# EAGLE design lpm (EAGLE 9.5.2)
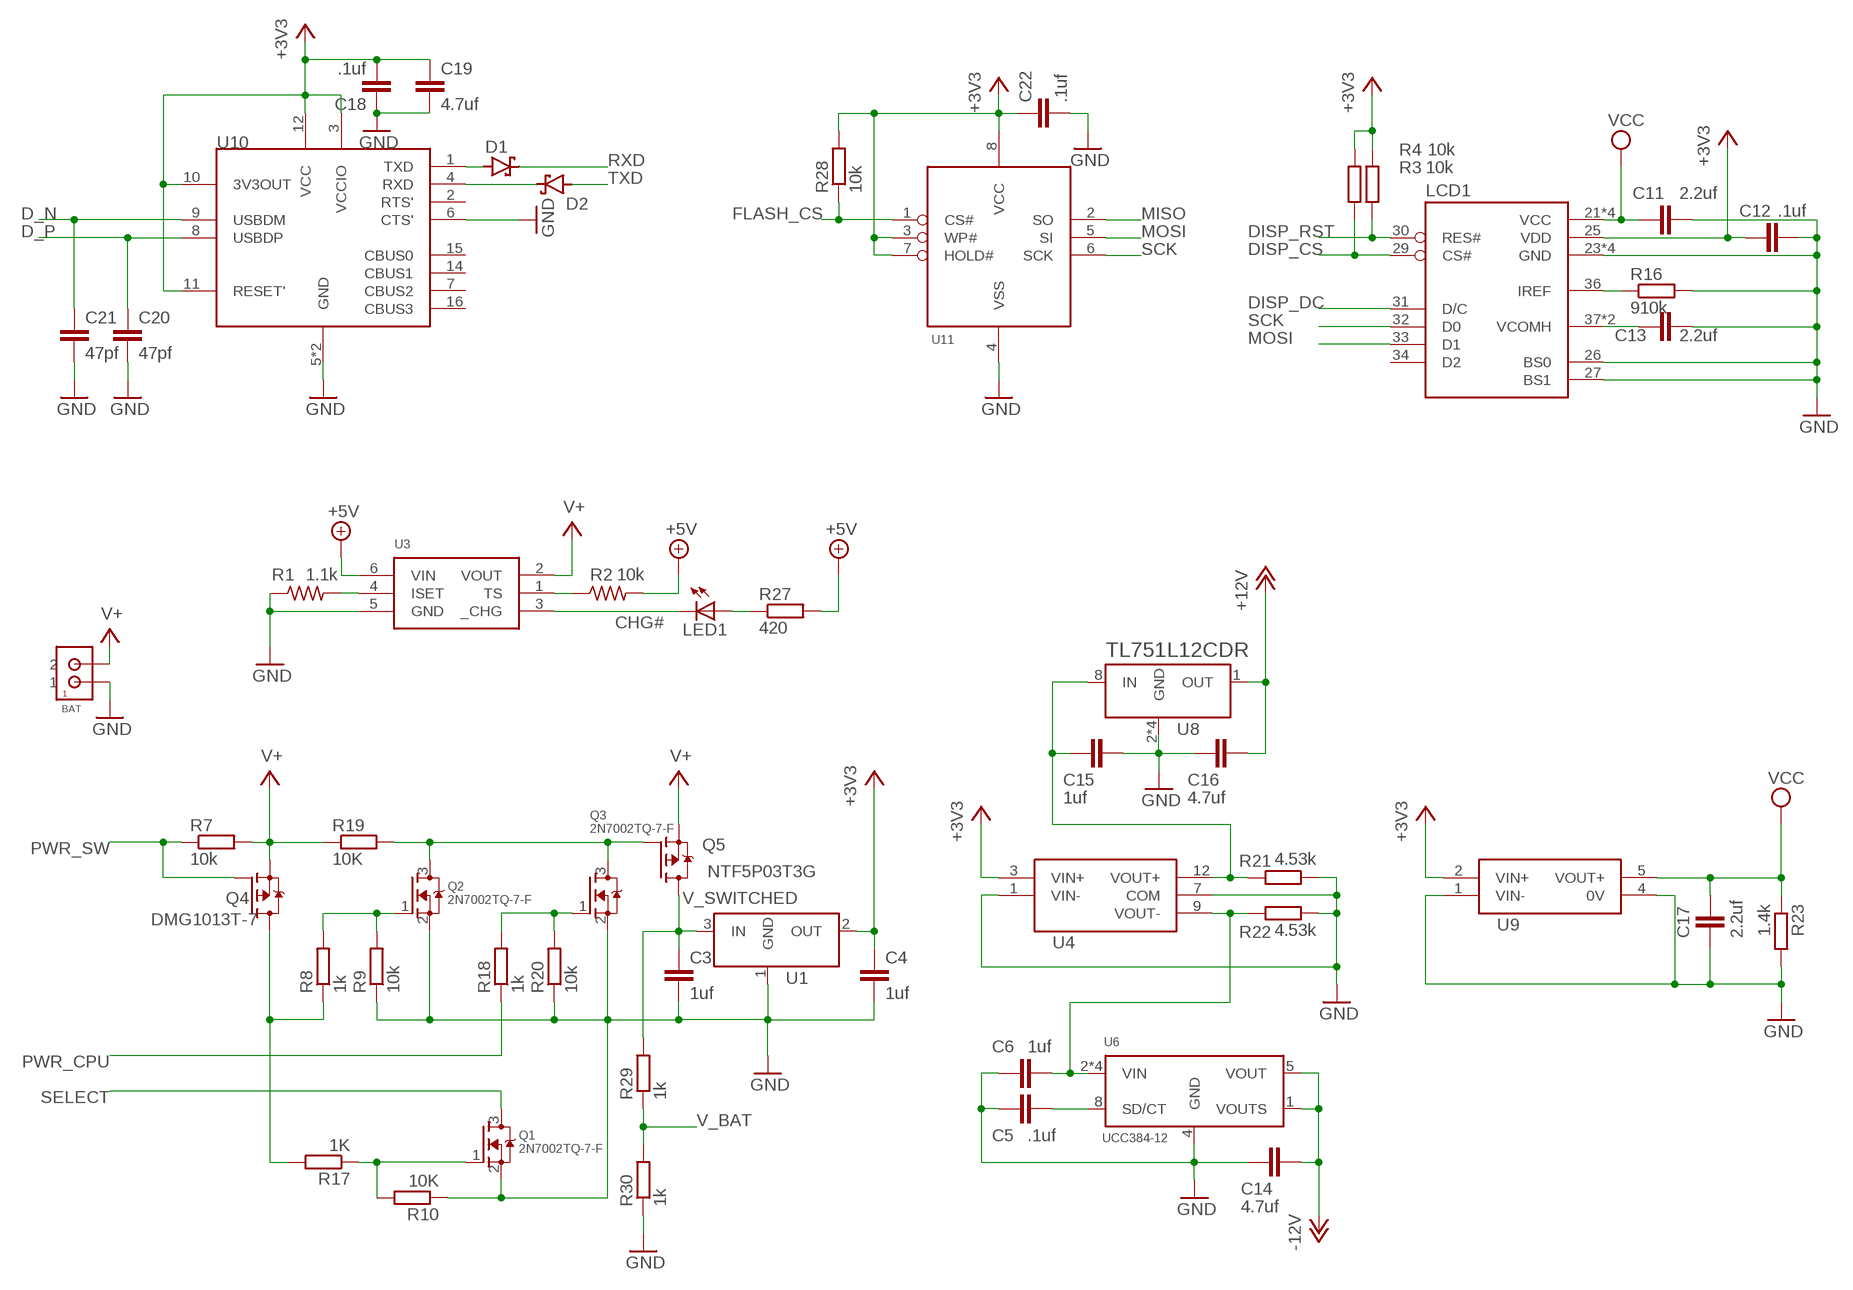
[diagram p0: schematic, sheet 1, part 1 of 2]
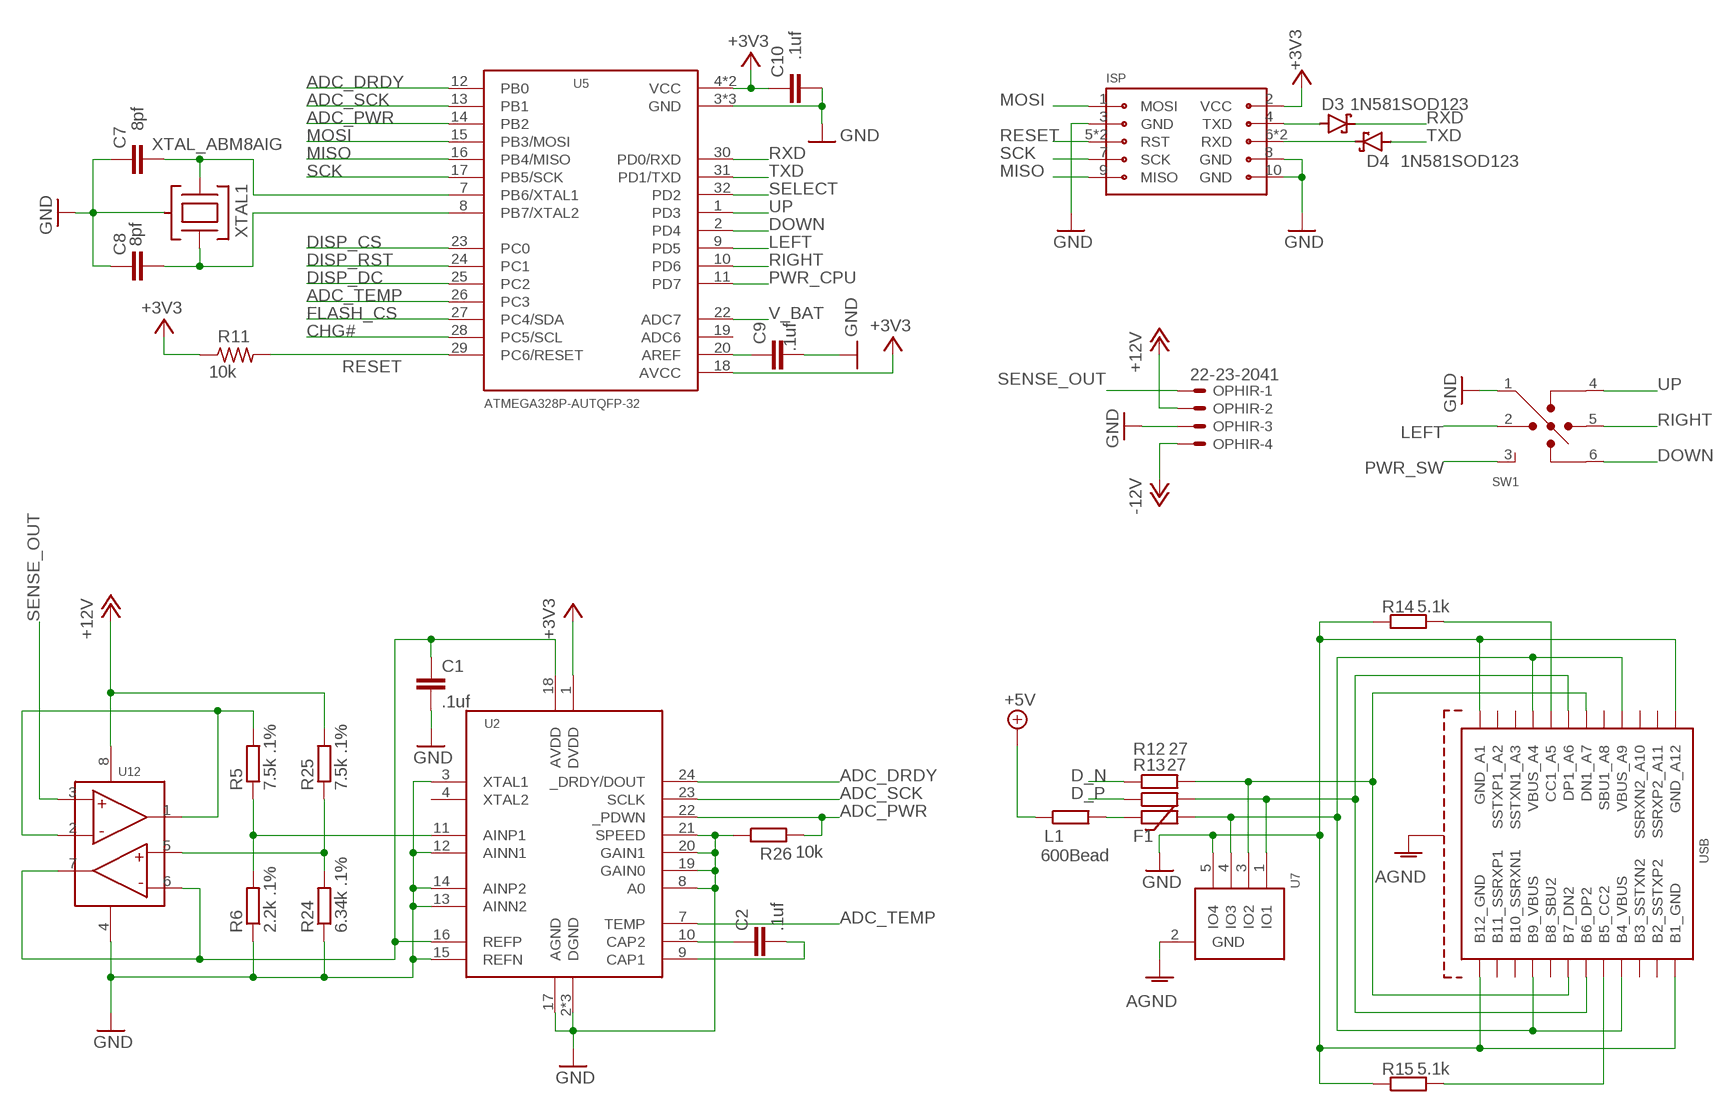
[diagram p1: schematic, sheet 1, part 2 of 2]

## Parts
BAT  2PIN_CONNJST_SH  [JST-SM02B-SRSS-TB]
C1  .1uf  C-EUC0805  [C0805]
C2  .1uf  C-EUC0805  [C0805]
C3  1uf  C-EUC0805  [C0805]
C4  1uf  C-EUC0805  [C0805]
C5  .1uf  C-EUC0805  [C0805]
C6  1uf  C-EUC0805  [C0805]
C7  8pf  C-EUC0805  [C0805]
C8  8pf  C-EUC0805  [C0805]
C9  .1uf  C-EUC0805  [C0805]
C10  .1uf  C-EUC0805  [C0805]
C11  2.2uf  C-EUC0805  [C0805]
C12  .1uf  C-EUC0805  [C0805]
C13  2.2uf  C-EUC0805  [C0805]
C14  4.7uf  C-EUC0805  [C0805]
C15  1uf  C-EUC0805  [C0805]
C16  4.7uf  C-EUC0805  [C0805]
C17  2.2uf  C-EUC0805  [C0805]
C18  .1uf  C-EUC0805  [C0805]
C19  4.7uf  C-EUC0805  [C0805]
C20  47pf  C-EUC0805  [C0805]
C21  47pf  C-EUC0805  [C0805]
C22  .1uf  C-EUC0805  [C0805]
D1  1N581SOD123  [SOD3715X135]
D2  1N581SOD123  [SOD3715X135]
D3  1N581SOD123  [SOD3715X135]
D4  1N581SOD123  [SOD3715X135]
F1  MF-PSHT035KX-2  PTC0805  [FUSC2113X120N]
ISP  10PIN_ISPTC2050  [TC2050-IDC]
L1  600Bead  R-EU_M0805  [M0805]
LCD1  EAOLEDL128-6  [EAOLEDL128-6]
LED1  LEDCHIPLED_0805  [CHIPLED_0805]
OPHIR  22-23-2041  [22-23-2041]
Q1  2N7002TQ-7-F  MOSFET-NSOT-523  [SOT50P160X80-3]
Q2  2N7002TQ-7-F  MOSFET-NSOT-523  [SOT50P160X80-3]
Q3  2N7002TQ-7-F  MOSFET-NSOT-523  [SOT50P160X80-3]
Q4  DMG1013T-7  MOSFET-PSOT-523  [SOT50P160X80-3]
Q5  NTF5P03T3G  MOSFET-PSOT-223  [SOT230P700X180-4]
R1  1.1k  R-US_R0805  [R0805]
R2  10k  R-US_R0805  [R0805]
R3  10k  R-EU_R0805  [R0805]
R4  10k  R-EU_R0805  [R0805]
R5  7.5k .1%  R-EU_R0805  [R0805]
R6  2.2k .1%  R-EU_R0805  [R0805]
R7  10k  R-EU_R0805  [R0805]
R8  1k  R-EU_R0805  [R0805]
R9  10k  R-EU_R0805  [R0805]
R10  10K  R-EU_R0805  [R0805]
R11  10k  R-US_R0805  [R0805]
R12  27  R-EU_M0805  [M0805]
R13  27  R-EU_M0805  [M0805]
R14  5.1k  R-EU_M0805  [M0805]
R15  5.1k  R-EU_M0805  [M0805]
R16  910k  R-EU_R0805  [R0805]
R17  1K  R-EU_R0805  [R0805]
R18  1k  R-EU_R0805  [R0805]
R19  10K  R-EU_R0805  [R0805]
R20  10k  R-EU_R0805  [R0805]
R21  4.53k  R-EU_R0805  [R0805]
R22  4.53k  R-EU_R0805  [R0805]
R23  1.4k  R-EU_R0805  [R0805]
R24  6.34k .1%  R-EU_R0805  [R0805]
R25  7.5k .1%  R-EU_R0805  [R0805]
R26  10k  R-EU_R0805  [R0805]
R27  420  R-EU_R0805  [R0805]
R28  10k  R-EU_R0805  [R0805]
R29  1k  R-EU_R0805  [R0805]
R30  1k  R-EU_R0805  [R0805]
SW1  JS-5208  [JS-5208]
U1  AZ1117E-3.3SOT-223  [SOT230P700X180-4]
U2  ADS1232  [SOP65P640X120-24]
U3  BQ21040SOT-23  [SOT95P280X145-6]
U4  NTA0315MC-R  [NTA0315MC-R]
U5  ATMEGA328P-AUTQFP-32  [QFP80P887X887X120-32]
U6  UCC384-12  UCC384-X  [SOIC127P599X175-8]
U7  ESDS314  [SOT95P282X145-5]
U8  TL751L12CDR  TL751  [SOIC127P599X175-8]
U9  ISE0312A  ISE312A  [ISE0312A]
U10  FT230XSSOP16  [SOP63P599X175-16]
U11  NV25640DWHFT3G  NV25640SOIC-8  [SOIC127P599X175-8]
U12  OPA2210VSSOP8  [SOP65P490X110-8]
USB  USBC_FEMALEUJ31-CH-31-SMT-TR  [USBC_UJ31-CH-31-SMT-TR]
XTAL1  XTAL_ABM8AIG  [XTAL_SMT_3.2X2.5]

## Nets
+3V3 [power]: C4.1 C10.1 C12.1 C18.2 C19.1 C22.1 ISP.2(VCC) LCD1.25(VDD) R3.2 R4.2 R11.1 R28.2 U1.2(OUT) U2.1(DVDD) U4.3(VIN+) U5.4(VCC) U5.6(VCC) U5.18(AVCC) U9.2(VIN+) U10.3(VCCIO) U10.10(3V3OUT) U10.11(RESET') U10.12(VCC) U11.3(WP#) U11.7(HOLD#) U11.8(VCC)
+5V [power]: L1.1 R2.2 R27.2 U3.6(VIN)
+12V [power]: C16.2 OPHIR.2 R25.2 U8.1(OUT) U12.8(V+)
-12V [power]: C14.2 OPHIR.4 U6.1(VOUTS) U6.5(VOUT)
ADC_DRDY: U2.24(_DRDY/DOUT) U5.12(PB0)
ADC_PWR: R26.2 U2.22(_PDWN) U5.14(PB2)
ADC_SCK: U2.23(SCLK) U5.13(PB1)
ADC_TEMP: U2.7(TEMP) U5.26(PC3)
AGND: U7.2(GND) USB.SHLD@1(SHLD) USB.SHLD@2(SHLD) USB.SHLD@3(SHLD) USB.SHLD@4(SHLD) USB.SHLD@5(SHLD) USB.SHLD@6(SHLD) USB.SHLD@7(SHLD) USB.SHLD@8(SHLD)
CHG#: LED1.C U3.3(_CHG) U5.28(PC5/SCL)
D_N: C21.1 R12.1 U10.9(USBDM)
D_P: C20.1 R13.1 U10.8(USBDP)
DISP_CS: LCD1.29(CS#) R4.1 U5.23(PC0)
DISP_DC: LCD1.31(D/C) U5.25(PC2)
DISP_RST: LCD1.30(RES#) R3.1 U5.24(PC1)
DOWN: SW1.6(D) U5.2(PD4)
FLASH_CS: R28.1 U5.27(PC4/SDA) U11.1(CS#)
GND [power]: BAT.1 C1.2 C3.2 C4.2 C5.1 C6.1 C7.1 C8.1 C9.2 C10.2 C11.2 C12.2 C13.2 C14.1 C15.2 C16.1 C17.2 C18.1 C19.2 C20.2 C21.2 C22.2 ISP.3(GND) ISP.8(GND) ISP.10(GND) LCD1.23(GND) LCD1.24(GND) LCD1.26(BS0) LCD1.27(BS1) LCD1.28(GND) LCD1.35(GND) OPHIR.3 Q1.2(S) Q2.2(S) Q3.2(S) R1.1 R6.1 R9.1 R10.1 R14.1 R15.1 R16.2 R20.1 R21.2 R22.2 R23.2 R24.1 R26.1 R30.1 SW1.1(C) U1.1(GND) U2.2(DGND) U2.3(XTAL1) U2.5(DGND) U2.6(DGND) U2.8(A0) U2.12(AINN1) U2.13(AINN2) U2.14(AINP2) U2.15(REFN) U2.17(AGND) U2.19(GAIN0) U2.20(GAIN1) U2.21(SPEED) U3.5(GND) U4.1(VIN-) U4.7(COM) U5.3(GND) U5.5(GND) U5.21(GND) U6.4(GND) U7.5(IO4) U8.2(GND) U8.3(GND) U8.6(GND) U8.7(GND) U9.1(VIN-) U9.4(0V) U10.5(GND) U10.6(CTS') U10.13(GND) U11.4(VSS) U12.4(V-) USB.A1(GND_A1) USB.A12(GND_A12) USB.B1(B1_GND) USB.B12(B12_GND) XTAL1.2(CASE) XTAL1.4(CASE)
LEFT: SW1.2(L) U5.9(PD5)
MISO: ISP.9(MISO) U5.16(PB4/MISO) U11.2(SO)
MOSI: ISP.1(MOSI) LCD1.33(D1) U5.15(PB3/MOSI) U11.5(SI)
N$1: R1.2 U3.4(ISET)
N$2: Q4.3(D) R8.1 R17.2
N$3: R2.1 U3.1(TS)
N$4: LED1.A R27.1
N$5: Q2.1(G) R8.2 R9.2
N$6: Q2.3(D) Q3.3(D) Q5.1(G) R19.2
N$8: R5.1 R6.2 U2.11(AINP1)
N$9: C7.2 U5.7(PB6/XTAL1) XTAL1.1
N$10: Q3.1(G) R18.2 R20.2
N$11: C8.2 U5.8(PB7/XTAL2) XTAL1.3
N$12: C9.1 U5.20(AREF)
N$13: R14.2 USB.A5(CC1_A5)
N$14: R15.2 USB.B5(B5_CC2)
N$15 [power]: F1.1 L1.2
N$16: Q1.1(G) R10.2 R17.1
N$17: LCD1.36(IREF) R16.1
N$18: C13.1 LCD1.37(VCOMH) LCD1.38(VCOMH)
N$19: R24.2 R25.1 U12.5(IN2+)
N$22: D3.A ISP.4(TXD)
N$23: D4.C ISP.6(RXD) ISP.L6(RXD)
N$24: D1.A U10.1(TXD)
N$25: C5.2 U6.8(SD/CT)
N$26: C6.2 R22.1 U4.9(VOUT-) U6.2(VIN) U6.3(VIN) U6.6(VIN) U6.7(VIN)
N$27: C15.1 R21.1 U4.12(VOUT+) U8.8(IN)
N$28: D2.C U10.4(RXD)
N$30: R5.2 U12.1(OUT1) U12.2(IN1-)
N$31: C1.1 U2.16(REFP) U2.18(AVDD) U12.6(IN2-) U12.7(OUT2)
N$32: R12.2 U7.3(IO2) USB.A7(DN1_A7) USB.B7(B7_DN2)
N$33: R13.2 U7.1(IO1) USB.A6(DP1_A6) USB.B6(B6_DP2)
N$34 [power]: F1.2 U7.4(IO3) USB.A4(VBUS_A4) USB.A9(VBUS_A9) USB.B4(B4_VBUS) USB.B9(B9_VBUS)
N$35: C2.1 U2.10(CAP2)
N$36: C2.2 U2.9(CAP1)
PWR_CPU: R18.1 U5.11(PD7)
PWR_SW: Q4.1(G) R7.1 SW1.3(P)
RESET: ISP.5(RST) ISP.L5(RST) R11.2 U5.29(PC6/RESET)
RIGHT: SW1.5(R) U5.10(PD6)
RXD: D1.C D3.C U5.30(PD0/RXD)
SCK: ISP.7(SCK) LCD1.32(D0) U5.17(PB5/SCK) U11.6(SCK)
SELECT: Q1.3(D) U5.32(PD2)
SENSE_OUT: OPHIR.1 U12.3(IN1+)
TXD: D2.A D4.A U5.31(PD1/TXD)
UP: SW1.4(U) U5.1(PD3)
V+ [power]: BAT.2 Q4.2(S) Q5.3(S) R7.2 R19.1 U3.2(VOUT)
V_BAT: R29.1 R30.2 U5.22(ADC7)
V_SWITCHED [power]: C3.1 Q5.2(D) Q5.4(D) R29.2 U1.3(IN)
VCC [power]: C11.1 C17.1 LCD1.21(VCC) LCD1.22(VCC) LCD1.39(VCC) LCD1.40(VCC) R23.1 U9.5(VOUT+)
Unconnected: LCD1.34(D2) U2.4(XTAL2) U5.19(ADC6) U10.2(RTS') U10.7(CBUS2) U10.14(CBUS1) U10.15(CBUS0) U10.16(CBUS3) USB.A2(SSTXP1_A2) USB.A3(SSTXN1_A3) USB.A8(SBU1_A8) USB.A10(SSRXN2_A10) USB.A11(SSRXP2_A11) USB.B2(B2_SSTXP2) USB.B3(B3_SSTXN2) USB.B8(B8_SBU2) USB.B10(B10_SSRXN1) USB.B11(B11_SSRXP1)

## Library data of the parts
BAT = pepin:2PIN_CONN: 2 pin connector.
C1-C22 = rcl:C-EU: CAPACITOR, European symbol; SPICEPREFIX: C
D1-D4 = pepin:1N581*: 1.0A SCHOTTKY BARRIER RECTIFIER Source: http://www.diodes.com/datasheets/ds23001.pdf
F1 = pepin:PTC
ISP = pepin:10PIN_ISP
L1 R3-R10 R12-R30 = rcl:R-EU_: RESISTOR, European symbol; SPICEPREFIX: R
LCD1 = pepin:EAOLEDL128-6
LED1 = adafruit:LED: LED OSRAM: - CHIPLED LG R971, LG N971, LY N971, LG Q971, LY Q971, LO R971, LY R971 LH N974, LH R974 LS Q976, LO Q976, LY Q976 LO Q996 - Hyper CHIPLED LW Q18S LB Q993, LB Q99A, LB R99A - SideLED LS A670, LO A670, LY A670, LG A670, LP A670 LB A673, LV A673, LT A673, LW A673 LH A674 LY A675 LS A676, LA A676, LO A676, LY A676, LW A676 LS A679, LY A679, LG A679 - Hyper Micro SIDELED® LS Y876, LA Y876, LO Y876, LY Y876 LT Y87S - SmartLED LW L88C, LW L88S LB L89C, LB L89S, LG L890 LS L89K, LO L89K, LY L89K LS L896, LA L896, LO L896, LY L896 - TOPLED LS T670, LO T670, LY T670, LG T670, LP T670 LSG T670, LSP T670, LSY T670, LOP T670, LYG T670 LG T671, LOG T671, LSG T671 LB T673, LV T673, LT T673, LW T673 LH T674 LS T676, LA T676, LO T676, LY T676, LB T676, LH T676, LSB T676, LW T676 LB T67C, LV T67C, LT T67C, LS T67K, LO T67K, LY T67K, LW E67C LS E67B, LA E67B, LO E67B, LY E67B, LB E67C, LV E67C, LT E67C LW T67C LS T679, LY T679, LG T679 LS T770, LO T770, LY T770, LG T770, LP T770 LB T773, LV T773, LT T773, LW T773 LH T774 LS E675, LA E675, LY E675, LS T675 LS T776, LA T776, LO T776, LY T776, LB T776 LHGB T686 LT T68C, LB T68C - Hyper Mini TOPLED® LB M676 - Mini TOPLED Santana® LG M470 LS M47K, LO M47K, LY M47K Source: http://www.osram.convergy.de/
OPHIR = con-molex:22-23-2041: .100" (2.54mm) Center Header - 4 Pin; MF: MOLEX; MPN: 22-23-2041; OC_FARNELL: 1462920; OC_NEWARK: 38C0355
Q1-Q3 = pepin:MOSFET-N: N-Channel Mosfet 2N7002E - 60V 260mA SOT23 [Digikey: 2N7002ET1GOSTR-ND] - REEL BSH103 - 30V 850mA SOT23 [Digikey: 568-5013-1-ND]
Q4 Q5 = pepin:MOSFET-P
R1 R2 R11 = adafruit:R-US_: RESISTOR, American symbol
SW1 = pepin:JS-5208
U1 = pepin:AZ1117E-3.3: 3.3v Linear Regulator
U2 = pepin:ADS1232
U3 = pepin:BQ21040
U4 = pepin:NTA0315MC-R
U5 = pepin:ATMEGA328P-AU
U6 = pepin:UCC384-X
U7 = pepin:ESDS314
U8 = pepin:TL751
U9 = pepin:ISE312A
U10 = pepin:FT230X
U11 = pepin:NV25640
U12 = pepin:OPA2210
USB = pepin:USBC_FEMALE
XTAL1 = pepin:XTAL_ABM8AIG

## Net classes
1 power: width 0.381 mm

## Board
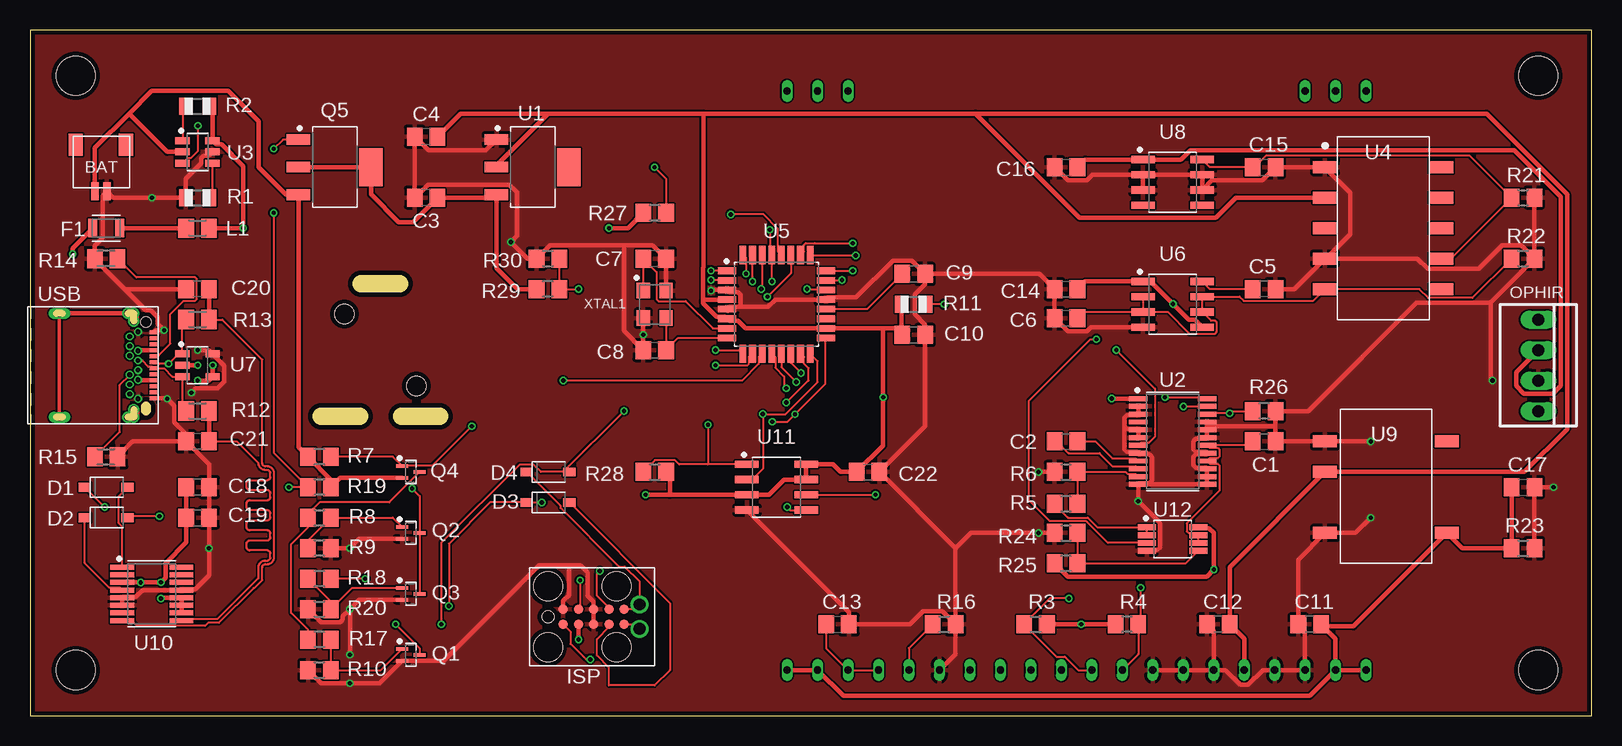
[diagram p2: board, top side]
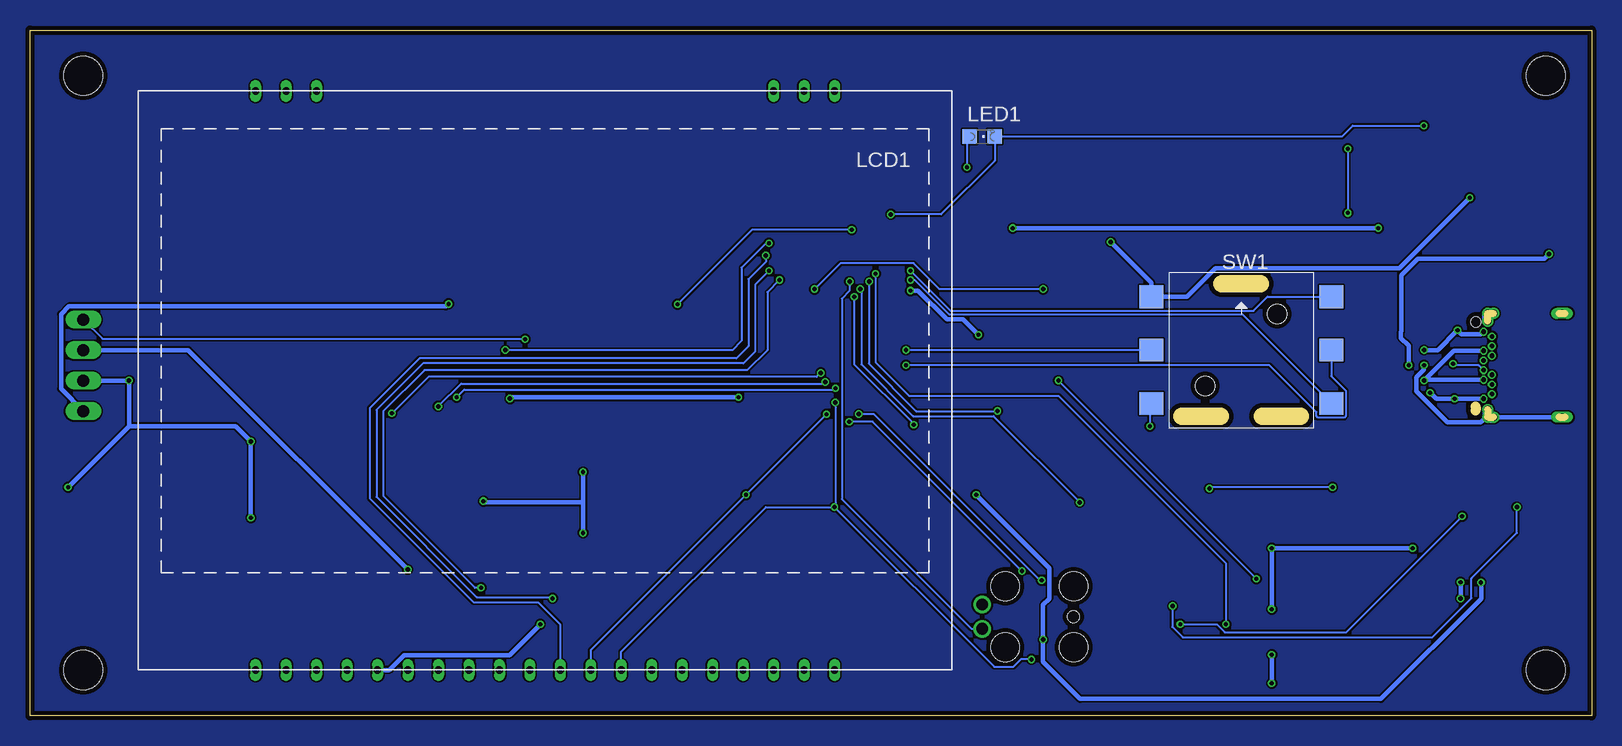
[diagram p3: board, bottom side, seen from below]

Size 130.18 x 57.15 mm. Coordinates in mm from the lower left corner, seen from the top.
Outline: 0,0 130.18,0 130.18,57.15 0,57.15 0,0
Copper layers (1*16): Top 0.035559375mm / dielectric 1.6mm / Bottom 0.035559375mm
Design rules "oshpark-2layer-tented": minimum track width 6mil, minimum drill 10mil, track to track 6mil, track to pad 6mil, pad to pad 6mil, via to via 6mil, smd to smd 6mil, copper to edge 15mil, drill to drill 6mil, minimum pad ring 5mil, minimum via ring 5mil, stop-mask expansion 2.5mil, vias tented up to drill 20mil, thermal gap 10mil
Holes 3.25 mm at 3.81,53.34 3.81,3.81 125.73,3.81 125.73,53.34

### Footprints (pad centres in the part's own frame; a part is rotated, then mirrored left to right if it is on the bottom)
JST-SM02B-SRSS-TB = smd 0.6 x 1.5: 1 -0.3,2.775; 2 0.7,2.775 | smd 1.2 x 1.8: NC1 -1.9,-1.1; NC2 2.3,-1.1
C0805 = smd 1.3 x 1.5: 1 -0.95,0; 2 0.95,0
SOD3715X135 = smd 1.01 x 0.73: A 1.78,0; C -1.78,0
FUSC2113X120N = smd 0.77 x 1.52: 1 -1.125,0; 2 1.125,0
TC2050-IDC = smd 0.787 x 0.787: 1 1.27,-0.635; 2 2.54,-0.635; 3 3.81,-0.635; 4 5.08,-0.635; 5 6.35,-0.635; 6 6.35,0.635; 7 5.08,0.635; 8 3.81,0.635; 9 2.54,0.635; 10 1.27,0.635 | drill 0.991: L5 7.62,-1.016; L6 7.62,1.016 | hole 0.991: 0,0 | hole 2.375: 5.715,2.54; 0,2.54; 0,-2.54; 5.715,-2.54
M0805 = smd 1.3 x 1.6: 1 -0.95,0; 2 0.95,0
EAOLEDL128-6 = drill 0.6 long: 1 -24.52,-21.59; 2 -21.98,-21.59; 3 -19.44,-21.59; 18 18.66,-21.59; 19 21.2,-21.59; 20 23.74,-21.59; 21 23.74,26.67; 22 21.2,26.67; 23 18.66,26.67; 24 16.12,26.67; 25 13.58,26.67; 26 11.04,26.67; 27 8.5,26.67; 28 5.96,26.67; 29 3.42,26.67; 30 0.88,26.67; 31 -1.66,26.67; 32 -4.2,26.67; 33 -6.74,26.67; 34 -9.28,26.67; 35 -11.82,26.67; 36 -14.36,26.67; 37 -16.9,26.67; 38 -19.44,26.67; 39 -21.98,26.67; 40 -24.52,26.67
CHIPLED_0805 = smd 1.2 x 1.2: A 0,-1.05; C 0,1.05
22-23-2041 = drill 1 long: 1 -3.81,0; 2 -1.27,0; 3 1.27,0; 4 3.81,0
SOT50P160X80-3 = smd 0.996 x 0.297: 1 -0.737,0.5; 2 -0.737,-0.5; 3 0.737,0
SOT230P700X180-4 = smd 1.965 x 0.889: 1 -3.023,2.3; 2 -3.023,0; 3 -3.023,-2.3 | smd 1.965 x 3.189: 4 3.023,0
R0805 = smd 1.1 x 1.4: 1 -1,0; 2 1,0
R0805' = smd 1.3 x 1.5: 1 -0.95,0; 2 0.95,0
JS-5208 = smd 2 x 1.9: 1 -7.5,4.45; 2 -7.5,0; 3 -7.5,-4.45; 4 7.5,4.45; 5 7.5,0; 6 7.5,-4.45 | hole 1.6: 3,3; -3,-3
SOP65P640X120-24 = smd 1.572 x 0.407: 1 -2.872,3.575; 2 -2.872,2.925; 3 -2.872,2.275; 4 -2.872,1.625; 5 -2.872,0.975; 6 -2.872,0.325; 7 -2.872,-0.325; 8 -2.872,-0.975; 9 -2.872,-1.625; 10 -2.872,-2.275; 11 -2.872,-2.925; 12 -2.872,-3.575; 13 2.872,-3.575; 14 2.872,-2.925; 15 2.872,-2.275; 16 2.872,-1.625; 17 2.872,-0.975; 18 2.872,-0.325; 19 2.872,0.325; 20 2.872,0.975; 21 2.872,1.625; 22 2.872,2.275; 23 2.872,2.925; 24 2.872,3.575
SOT95P280X145-6 = smd 1.209 x 0.584: 1 -1.253,0.95; 2 -1.253,0; 3 -1.253,-0.95; 4 1.253,-0.95; 5 1.253,0; 6 1.253,0.95
NTA0315MC-R = smd 1 x 2: 1 -5.08,-5.08; 3 -2.54,-5.08; 5 0,-5.08; 7 2.54,-5.08; 9 5.08,-5.08; 10 5.08,4.62; 12 2.54,4.62; 14 0,4.62; 16 -2.54,4.62; 18 -5.08,4.62
QFP80P887X887X120-32 = smd 1.504 x 0.547: 1 -4.11,2.8; 2 -4.11,2; 3 -4.11,1.2; 4 -4.11,0.4; 5 -4.11,-0.4; 6 -4.11,-1.2; 7 -4.11,-2; 8 -4.11,-2.8; 17 4.11,-2.8; 18 4.11,-2; 19 4.11,-1.2; 20 4.11,-0.4; 21 4.11,0.4; 22 4.11,1.2; 23 4.11,2; 24 4.11,2.8 | smd 0.547 x 1.504: 9 -2.8,-4.11; 10 -2,-4.11; 11 -1.2,-4.11; 12 -0.4,-4.11; 13 0.4,-4.11; 14 1.2,-4.11; 15 2,-4.11; 16 2.8,-4.11; 25 2.8,4.11; 26 2,4.11; 27 1.2,4.11; 28 0.4,4.11; 29 -0.4,4.11; 30 -1.2,4.11; 31 -2,4.11; 32 -2.8,4.11
SOIC127P599X175-8 = smd 1.965 x 0.602: 1 -2.47,1.905; 2 -2.47,0.635; 3 -2.47,-0.635; 4 -2.47,-1.905; 5 2.47,-1.905; 6 2.47,-0.635; 7 2.47,0.635; 8 2.47,1.905
SOT95P282X145-5 = smd 1.189 x 0.589: 1 -1.264,0.95; 2 -1.264,0; 3 -1.264,-0.95; 4 1.264,-0.95; 5 1.264,0.95
ISE0312A = smd 1 x 2: 1 0,0; 2 2.54,0; 4 7.62,0; 5 7.62,10.16; 8 0,10.16
SOP63P599X175-16 = smd 1.972 x 0.414: 1 -2.471,2.223; 2 -2.471,1.587; 3 -2.471,0.953; 4 -2.471,0.318; 5 -2.471,-0.318; 6 -2.471,-0.953; 7 -2.471,-1.587; 8 -2.471,-2.223; 9 2.471,-2.223; 10 2.471,-1.587; 11 2.471,-0.953; 12 2.471,-0.318; 13 2.471,0.318; 14 2.471,0.953; 15 2.471,1.587; 16 2.471,2.223
SOP65P490X110-8 = smd 1.471 x 0.481: 1 -2.15,0.975; 2 -2.15,0.325; 3 -2.15,-0.325; 4 -2.15,-0.975; 5 2.15,-0.975; 6 2.15,-0.325; 7 2.15,0.325; 8 2.15,0.975
USBC_UJ31-CH-31-SMT-TR = smd 0.32 x 0.7: A1 -2.75,-0.35; A2 -2.25,-0.35; A3 -1.75,-0.35; A4 -1.25,-0.35; A5 -0.75,-0.35; A6 -0.25,-0.35; A7 0.25,-0.35; A8 0.75,-0.35; A9 1.25,-0.35; A10 1.75,-0.35; A11 2.25,-0.35; A12 2.75,-0.35 | drill 0.4 pad 0.6: B1 2.8,-1.66; B2 2.4,-2.36; B3 1.6,-2.36; B4 1.2,-1.66; B5 0.8,-2.36; B6 0.4,-1.66; B7 -0.4,-1.66; B8 -0.8,-2.36; B9 -1.2,-1.66; B10 -1.6,-2.36; B11 -2.4,-2.36; B12 -2.8,-1.66 | drill 0.6 pad 0.9: SHLD@1 -4.33,-2.01; SHLD@2 -3.68,-2.01; SHLD@3 -4.33,-2.51; SHLD@4 3.68,-2.01; SHLD@5 4.33,-2.01; SHLD@6 4.33,-2.51 | drill 0.6 pad 0.9 long: SHLD@7 4.33,-8.21; SHLD@8 -4.33,-8.21 | hole 0.85: -3.6,-1.01
XTAL_SMT_3.2X2.5 = smd 1.3 x 1.1: 1 -1.15,-0.95; 2 1.15,-0.95; 3 1.15,0.95; 4 -1.15,0.95

### Placement (x,y rotation side)
BAT  6.11,46.49 180 top
C1  102.87,22.86 0 top
C2  86.36,22.86 0 top
C3  33.02,43.18 180 top
C4  33.02,48.26 180 top
C5  102.87,35.56 180 top
C6  86.36,33.15 0 top
C7  52.07,38.1 180 top
C8  52.07,30.48 0 top
C9  73.66,36.83 0 top
C10  73.66,31.75 0 top
C11  106.68,7.62 180 top
C12  99.06,7.62 180 top
C13  67.31,7.62 0 top
C14  86.36,35.56 0 top
C15  102.87,45.72 0 top
C16  86.36,45.72 0 top
C17  124.46,19.05 0 top
C18  13.97,19.05 180 top
C19  13.97,16.51 0 top
C20  13.97,35.56 180 top
C21  13.97,22.86 180 top
C22  69.85,20.32 0 top
D1  6.35,19.05 0 top
D2  6.35,16.51 0 top
D3  43.18,17.78 0 top
D4  43.18,20.32 0 top
F1  6.35,40.64 180 top
ISP  43.18,8.26 0 top
L1  13.97,40.64 180 top
LCD1  87.63,30.48 180 bottom
LED1  50.8,48.26 270 bottom
OPHIR  125.73,29.21 270 top
Q1  31.75,5.08 0 top
Q2  31.75,15.24 0 top
Q3  31.75,10.16 0 top
Q4  31.75,20.32 0 top
Q5  25.4,45.72 0 top
R1  13.97,43.18 0 top
R2  13.97,50.8 0 top
R3  10k  [R0805']  83.82,7.62 0 top
R4  10k  [R0805']  91.44,7.62 180 top
R5  7.5k .1%  [R0805']  86.36,17.65 180 top
R6  2.2k .1%  [R0805']  86.36,20.32 0 top
R7  10k  [R0805']  24.13,21.59 180 top
R8  1k  [R0805']  24.13,16.51 0 top
R9  10k  [R0805']  24.13,13.97 180 top
R10  10K  [R0805']  24.13,3.81 0 top
R11  73.66,34.29 0 top
R12  13.97,25.4 180 top
R13  13.97,33.02 180 top
R14  6.35,38.1 0 top
R15  6.35,21.59 180 top
R16  910k  [R0805']  76.2,7.62 0 top
R17  1K  [R0805']  24.13,6.35 180 top
R18  1k  [R0805']  24.13,11.43 180 top
R19  10K  [R0805']  24.13,19.05 180 top
R20  10k  [R0805']  24.13,8.89 0 top
R21  4.53k  [R0805']  124.46,43.18 0 top
R22  4.53k  [R0805']  124.46,38.1 0 top
R23  1.4k  [R0805']  124.46,13.97 0 top
R24  6.34k .1%  [R0805']  86.36,15.24 0 top
R25  7.5k .1%  [R0805']  86.36,12.7 180 top
R26  10k  [R0805']  102.87,25.4 180 top
R27  420  [R0805']  52.07,41.91 180 top
R28  10k  [R0805']  52.07,20.32 0 top
R29  1k  [R0805']  43.18,35.56 180 top
R30  1k  [R0805']  43.18,38.1 0 top
SW1  29.21,30.48 0 bottom
U1  41.91,45.72 0 top
U2  95.25,22.86 0 top
U3  13.97,46.99 0 top
U4  113.03,40.64 270 top
U5  62.23,34.29 0 top
U6  95.25,34.29 0 top
U7  13.97,29.21 0 top
U8  95.25,44.45 0 top
U9  107.95,22.86 270 top
U10  10.16,10.16 0 top
U11  62.23,19.05 0 top
U12  95.25,14.73 0 top
USB  10.67,29.21 270 top
XTAL1  52.07,34.29 270 top

### Tracks (layer width: path | path; a pad name or v marks a point on that pad's centre or on a via)
3V3
  pour Bottom: -2.54,59.69 133.35,59.69 133.35,-2.54 -2.54,-2.54
+3V3  (via drill 0.35)
  Top 0.381: U4.3 100.5,43.18 98.84,41.52 87.47,41.52 78.82,50.17 | 56.13,50.17 43.18,50.17 | 56.13,50.17 78.82,50.17 | 56.12,34.67 56.12,34.38 57.23,33.27 57.94,33.27 U5.6 58.3,32.91 59.01,32.91 59.63,32.29 U5.18 71.12,32.29 | 56.13,50.17 56.13,37.36 56.12,37.35 56.12,34.67 | U5.4 56.14,34.69 56.12,34.67 | 78.82,50.17 121.44,50.17 128.13,43.48 128.13,23.89 124.56,20.32 U9.2 100.01,12.38 C12.1 101.21,6.42 LCD1.25 | R3.2 v87.63,7.62 R4.2 | C18.2 C19.1 13.02,14.45 11.3,12.73 11.3,11.5 v10.92,11.12 9.24,11.12 v9.23,11.11 U10.3 | v45.72,6.35 ISP.2 | U10.10 U10.11 U10.12 10.99,9.84 v10.92,9.78 | U2.1 v90.17,26.43 | 71.12,32.29 72.17,32.29 C10.1 72.66,31.8 R11.1 | 71.12,32.29 v71.12,26.54 71.12,22.52 68.92,20.32 C22.1 67.56,20.32 66.93,20.95 U11.8 U11.7 62.87,19.68 61.59,18.41 U11.3 53.34,18.41 | 53.34,18.41 v51.31,18.41 | R28.2 53.34,20 53.34,18.41 | 43.18,50.17 38.89,45.88 U1.2 | 43.18,50.17 35.88,50.17 C4.1
  Bottom 0.381: v87.63,7.62 90.2,5.05 99,5.05 100.24,3.81 LCD1.25 | v51.31,18.41 45.2,12.31 45.2,9.77 45.72,9.25 v45.72,6.35 45.72,4.5 42.64,1.42 17.56,1.42 9.21,9.77 9.21,11.1 v9.23,11.11 | v10.92,11.12 v10.92,9.78 | v71.12,26.54 90.06,26.54 v90.17,26.43
+5V  (via drill 0.35)
  Top 0.381: R2.2 15.22,50.55 U3.6 15.54,47.62 15.97,47.62 17.78,45.81 v17.78,40.64 L1.1 | v48.26,40.64 49.85,40.64 R27.2
  Bottom 0.381: v17.78,40.64 v48.26,40.64
+12V  (via drill 0.35)
  Top 0.381: C16.2 87.94,46.35 U8.1 95.95,46.35 96.71,47.12 123.74,47.12 127.6,43.26 127.6,27.51 126.93,26.85 124.53,26.85 123.89,27.49 123.89,28.64 OPHIR.2 | U12.8 97.47,15.64 98.28,15.64 98.68,15.24 v98.68,12.19 98.09,11.61 86.52,11.61 85.42,12.7 R25.2
  Bottom 0.381: v98.68,12.19 116.97,30.48 OPHIR.2
-12V  (via drill 0.35)
  Top 0.381: C14.2 87.94,36.2 U6.1 93.41,36.2 v95.28,34.32 96.59,33.01 97.09,33.01 U6.5
  Bottom 0.381: v95.28,34.32 95.49,34.11 126.93,34.11 127.57,33.47 127.57,27.24 OPHIR.4
ADC_DRDY  (via drill 0.35)
  Top 0.152: U5.12 62.13,29.88 62.13,29.01 62.87,28.27 62.87,27.3 v63.04,27.3 | v94.61,26.54 98.01,26.54 U2.24
  Bottom 0.152: v63.04,27.3 63.16,27.18 93.98,27.18 v94.61,26.54
ADC_PWR  (via drill 0.35)
  Top 0.152: U5.14 63.43,29.41 v64.26,28.57 | R26.2 100.2,25.4 v100.01,25.2 98.19,25.2 U2.22
  Bottom 0.152: v64.26,28.57 64.59,28.25 96.97,28.25 v100.01,25.2
ADC_SCK  (via drill 0.35)
  Top 0.152: U5.13 62.63,29.06 v63.88,27.81 | v96.14,25.78 U2.23
  Bottom 0.152: v63.88,27.81 64.01,27.69 94.23,27.69 v96.14,25.78
ADC_TEMP  (via drill 0.35)
  Top 0.152: U5.26 64.53,38.7 64.53,39.25 64.66,39.38 65.4,39.38 65.41,39.37 v68.58,39.37 | U2.7 92.6,22.75 93.26,22.75 93.77,23.27 93.77,27.26 v90.55,30.48
  Bottom 0.152: v68.58,39.37 68.83,39.37 70.87,37.34 70.87,31.24 71.63,30.48 v90.55,30.48
AGND  (via drill 0.35)
  Top 0.305: USB.SHLD@8 USB.SHLD@7
  Top 0.381: USB.SHLD@2 USB.SHLD@1 USB.SHLD@3 USB.SHLD@8 | USB.SHLD@4 USB.SHLD@5 USB.SHLD@6 | U7.2 v13.97,29.21
  Bottom 0.381: USB.SHLD@6 USB.SHLD@7 | USB.SHLD@5 8.83,24.88 9.24,24.46 12.04,24.46 14.62,27.04 14.62,28.21 13.97,28.85 v13.97,29.21
CHG#  (via drill 0.35)
  Top 0.152: 62.33,38.71 62.33,40.61 61.16,41.78 v58.42,41.78 | 62.33,38.71 62.33,38.7 | U3.3 13.15,46.47 13.42,46.47 13.99,47.05 v13.99,49.17 | U5.28 62.56,38.41 62.56,38.56 62.41,38.71 62.33,38.71
  Bottom 0.152: v13.99,49.17 19.91,49.17 20.82,48.26 LED1.C 49.75,46.26 54.23,41.78 v58.42,41.78
D_N
  Top 0.152: C21.1 17.25,22.86 19.05,21.05 arc90 19.62,20.48 19.77,20.48 arc-90 20.04,20.22 20.04,19.91 arc-90 19.77,19.64 18.33,19.64 arc90 18.06,19.38 18.06,19.07 arc90 18.33,18.81 19.77,18.81 arc-90 20.04,18.54 20.04,18.24 arc-90 19.77,17.97 18.33,17.97 arc90 18.06,17.7 18.06,17.4 arc90 18.33,17.13 19.77,17.13 arc-90 20.04,16.86 20.04,16.56 arc-90 19.77,16.29 18.33,16.29 arc90 18.06,16.03 18.06,15.72 arc90 18.33,15.46 19.77,15.46 arc-90 20.04,15.19 20.04,14.88 arc-90 19.77,14.62 18.33,14.62 arc90 18.06,14.35 18.06,14.04 arc90 18.33,13.78 19.77,13.78 arc-90 20.04,13.51 20.04,13.21 arc-90 19.77,12.94 19.62,12.94 arc90 19.05,12.37 19.05,11.43 18.99,11.43 15.61,8.05 12.74,8.05 U10.9
  Top 0.381: C21.1 R12.1
D_P
  Top 0.152: R13.1 16.02,33.02 19.36,29.69 19.36,21.05 arc90 19.62,20.79 19.77,20.79 arc-90 20.34,20.22 20.34,13.21 arc-90 19.77,12.63 19.62,12.63 arc90 19.36,12.37 19.36,11.3 18.69,10.64 18.63,10.64 15.73,7.74 14.84,7.74 14.6,7.5 8.9,7.5 8.47,7.94 U10.8
  Top 0.381: R13.1 C20.1
DISP_CS  (via drill 0.35)
  Top 0.152: LCD1.29 92.39,5.15 R4.1 92.58,7.81 v92.58,10.67 | U5.23 67.66,36.29 v67.69,36.32
  Bottom 0.152: v67.69,36.32 68.71,35.31 68.71,30.48 70.38,28.8 97.3,28.8 100.73,25.37 100.73,18.32 93.08,10.67 v92.58,10.67
DISP_DC  (via drill 0.35)
  Top 0.152: U5.25 68.79,38.4 v68.83,38.35
  Bottom 0.152: v68.83,38.35 68.83,37.83 70.28,36.39 70.28,30.81 71.3,29.79 97.67,29.79 101.85,25.62 101.85,18.12 93.18,9.45 87.8,9.45 85.97,7.62 LCD1.31
DISP_RST  (via drill 0.35)
  Top 0.152: LCD1.30 87.38,3.81 86.25,4.94 85.55,4.94 R3.1 85.03,9.78 v86.61,9.78 | U5.24 68.45,37.09 68.45,37.08 v68.58,37.08
  Bottom 0.152: v68.58,37.08 69.72,35.94 69.72,30.35 70.71,29.36 97.42,29.36 101.29,25.49 101.29,18.25 92.93,9.88 86.72,9.88 v86.61,9.78
DOWN  (via drill 0.35)
  Top 0.152: U5.2 56.8,36.29 v56.77,36.32
  Bottom 0.152: v56.77,36.32 56.44,36.32 53.56,33.45 29.13,33.45 SW1.6
FLASH_CS  (via drill 0.35)
  Top 0.152: U5.27 63.43,36.89 v61.47,34.92 | U11.1 56.52,20.95 | 56.52,20.95 54.11,20.95 53.77,21.3 52.1,21.3 R28.1 | v56.52,24.26 56.52,20.95
  Bottom 0.152: v61.47,34.92 61.47,29.31 56.52,24.36 v56.52,24.26
GND  (via drill 0.35)
  Top 0.381: 59.01,34.07 59.22,34.27 59.22,35.11 59.01,35.31 58.3,35.31 U5.3 56.83,35.49 v56.77,35.43 | U5.5 58.3,34.07 59.01,34.07 | 59.01,34.07 61.53,34.07 62.15,34.69 U5.21 66.52,34.87 68.87,34.87 71.92,37.92 73.5,37.92 74.59,36.83 C9.2 | U10.6 U10.5 7.77,9.93 8.83,9.93 9.38,10.48 U10.13 12.72,10.56 13.76,10.56 14.92,11.72 v14.92,13.97 C19.2 C18.1 14.92,20.96 C21.2 | U3.5 14.91,46.67 14.48,46.67 14.28,46.47 14.28,46.04 12.97,44.74 R1.1 v10.16,43.18 6.95,43.18 BAT.1 6.05,43.36 6.05,39.84 5.4,39.19 R14.1 5.4,38.06 7.91,35.56 | 7.91,35.56 9.66,33.81 10.07,33.81 10.65,33.22 10.65,32.65 v11.18,32.13 10.49,32.13 USB.A1 | C20.2 7.91,35.56 | v13.97,30.48 14.91,30.48 U7.5 15.23,30.13 16.17,29.19 16.17,27.82 15.64,27.3 13.83,27.3 v13.46,26.92 | C21.2 13.02,23.46 12.03,24.46 12.03,25.82 v11.43,26.42 11.39,26.46 USB.A12 | R9.1 v26.67,13.97 27.44,14.74 Q2.2 | v26.67,8.89 26.07,8.29 26.07,8 25.87,7.8 24.29,7.8 23.2,8.89 R20.1 | v26.67,8.89 27.44,9.66 Q3.2 | R10.1 23.2,3.81 24.29,2.72 v26.67,2.72 29.15,2.72 Q1.2 34.48,4.58 42.45,12.55 44.96,12.55 | v26.67,8.89 v26.67,5.08 | ISP.10 44.45,9.58 44.94,10.07 44.94,12.54 44.96,12.55 | ISP.3 ISP.8 46.99,9.53 46.49,10.02 46.49,11.95 45.89,12.55 44.96,12.55 | 32.09,48.26 32.07,48.24 C3.2 32.09,43.18 33.18,44.27 39.95,44.27 40.59,43.63 40.59,39.99 v40.09,39.48 41.47,38.1 R30.1 42.24,38.1 43.34,39.19 49.53,39.19 | C4.2 32.09,48.26 | 32.09,48.26 33.23,47.12 37.98,47.12 U1.1 | XTAL1.4 C7.1 53.01,38.1 51.91,39.19 49.53,39.19 | XTAL1.2 v51.12,31.75 C8.1 49.53,32.07 49.53,39.19 | C9.2 74.61,35.98 73.77,35.13 73.77,33.45 74.61,32.6 C10.2 74.61,24.13 C22.2 77.15,13.97
  Top 0.381: C9.2 84.14,36.83 C14.1 C6.1 86.5,32.05 88.1,32.05 88.43,32.38 U6.4 | R16.2 77.15,13.97 | 77.15,13.97 78.42,15.24 v84.07,15.24 R24.1 | R16.2 77.15,5.15 LCD1.35 | R16.2 77.14,7.62 76.04,8.71 74.46,8.71 73.36,7.62 C13.2 68.26,8.64 U11.4 | C12.2 98.67,7.06 LCD1.26 | LCD1.26 LCD1.27 LCD1.28 | LCD1.26 99.64,3.81 100.88,2.57 101.54,2.57 102.78,3.81 LCD1.24 LCD1.23 106.29,7.06 C11.2 105.73,13.02 U9.4 110.49,15.24 v111.76,16.51 | U2.2 U2.3 92.28,25.03 91.45,25.03 91.25,24.83 91.25,24.14 | 91.25,24.14 91.45,23.94 92.28,23.94 U2.5 U2.6 | 91.25,24.14 91.25,22.19 91.45,21.99 92.28,21.99 U2.8 92.48,21.78 93.31,21.78 93.51,21.58 93.51,19.59 93.31,19.39 92.48,19.39 U2.12 | U2.12 U2.13 U2.14 U2.15 98.02,20.69 97.19,20.69 96.99,20.89 96.99,21.58 97.19,21.78 98.02,21.78 U2.17 98.02,21.99 97.19,21.99 96.99,22.19 96.99,22.88 97.19,23.08 98.02,23.08 U2.19 U2.20 | U2.20 U2.21 | U2.12 v92.38,17.89 94.18,16.09 94.18,14.02 93.98,13.82 93.17,13.82 U12.4 | R6.1 v84.07,20.32 | C16.1 85.42,45.72 86.52,44.63 88.1,44.63 88.56,45.09 U8.2 | U8.3 U8.2 | U8.2 U8.7 U8.6 98.53,44.63 102.71,44.63 103.81,45.72 C15.2 U4.1 107.95,45.67 110.06,43.57 110.06,40.12 108.03,38.1 U4.7 | U4.7 105.41,35.56 C5.1 | U4.7 115.67,38.1 116.51,37.26 120.78,37.26 122.72,39.19 124.3,39.19 125.39,38.1 | R21.2 R22.2 125.39,38.1 | 121.75,34.46 121.71,34.41 115.57,34.41 106.56,25.4 R26.1 103.82,24.13 | 121.75,34.46 125.39,38.1 | R23.2 C17.2 v127,19.05 | 121.75,34.46 121.75,28.11 v121.92,27.94 | v111.76,22.86 U9.1 C1.2 103.82,24.13 | 103.82,24.13 98.42,24.13 U2.20 | R15.1 8.57,22.86 C21.2
  Bottom 0.381: USB.B12 9.05,32.01 9.24,31.81 10.86,31.81 v11.18,32.13 12.83,30.48 v13.97,30.48 | USB.B1 v11.44,26.41 | v11.44,26.41 v11.43,26.42 | v13.46,26.92 12.95,26.41 v11.44,26.41 | v14.92,13.97 v26.67,13.97 v26.67,8.89 | v26.67,5.08 v26.67,2.72 | v10.16,43.18 16.04,37.3 31.35,37.3 33.72,34.93 SW1.1 36.71,36.11 v40.09,39.48 | v51.12,31.75 52.4,33.03 53.74,33.03 56.14,35.43 v56.77,35.43 | v84.07,20.32 84.07,17.78 | 84.07,17.78 v84.07,15.24 | v92.38,17.89 92.27,17.78 84.07,17.78 | OPHIR.3 v121.92,27.94 121.92,24.13 | v127,19.05 121.92,24.13 | 121.92,24.13 113.03,24.13 v111.76,22.86 v111.76,16.51
  pour Top: -1.27,58.42 132.08,58.42 132.08,-1.27 -1.27,-1.27
LEFT  (via drill 0.35)
  Top 0.152: v57.15,30.48 59.13,30.48 U5.9
  Bottom 0.152: SW1.2 v57.15,30.48
MISO  (via drill 0.35)
  Top 0.152: v45.85,11.3 45.85,9.02 ISP.9 | U5.16 65.66,29.55 65.66,27.81 62.99,25.15 v61.09,25.15 61.09,20.57 60.2,19.68 U11.2
  Bottom 0.152: v61.09,25.15 59.83,25.15 45.99,11.3 v45.85,11.3
MOSI  (via drill 0.35)
  Top 0.152: v63.12,17.4 63.37,17.14 U11.5 | v63.04,26.11 64.87,27.94 64.9,27.94 64.9,28.96 64.53,29.33 64.53,29.88 U5.15 | ISP.1 45.06,7.01 45.06,6 46.37,4.7 v46.7,4.7
  Bottom 0.152: v63.04,26.11 63.04,17.47 v63.12,17.4 | v63.12,17.4 49.79,4.07 48.21,4.07 47.59,4.7 v46.7,4.7 | LCD1.33 80.89,5.34 68.83,17.4 v63.12,17.4
N$1
  Top 0.152: R1.2 15.22,43.43 U3.4
N$2
  Top 0.152: Q4.3 29.95,17.78 24.13,17.78 23.18,16.83 R8.1 23.18,15.69 21.77,14.28 21.77,8.58 23.18,7.17 R17.2
N$3
  Top 0.152: R2.1 12.72,50.55 U3.1
N$4  (via drill 0.35)
  Top 0.152: v52.07,45.72 53.02,44.77 R27.1
  Bottom 0.152: LED1.A 52.07,48.04 v52.07,45.72
N$5
  Top 0.152: Q2.1 30.24,16.51 R8.2 23.18,14.61 R9.2
N$6  (via drill 0.35)
  Top 0.152: Q5.1 21.1,48.02 v20.32,47.24 | v20.32,41.91 20.32,21.91 R19.2 v21.59,19.05 | Q3.3 Q2.3 32.49,18.31 v31.86,18.94
  Bottom 0.152: v20.32,47.24 v20.32,41.91 | v21.59,19.05 31.75,19.05 v31.86,18.94
N$8
  Top 0.152: U2.11 92.16,20.15 91.5,20.15 91.33,20.32 R6.2 R5.1
N$9
  Top 0.152: XTAL1.1 C7.2 52.24,36.98 52.24,34.7 52.38,34.56 54.66,34.56 56.93,32.29 U5.7
N$10
  Top 0.152: R18.2 25.08,9.53 R20.2 26.85,10.66 Q3.1
N$11
  Top 0.152: XTAL1.3 C8.2 54.03,31.49 U5.8
N$12
  Top 0.152: C9.1 69.77,33.89 U5.20
N$13
  Top 0.152: USB.A5 10.4,30.04 10.73,30.04 11.71,31.02 11.71,33.48 12.81,34.58 13.77,34.58 13.9,34.72 13.9,36.41 13.77,36.54 8.86,36.54 R14.2
N$14
  Top 0.152: R15.2 7.48,23.67 7.48,27.57 8.31,28.4 USB.B5
N$15
  Top 0.381: F1.1 L1.2
N$16
  Top 0.152: R17.1 R10.2 29.24,3.81 Q1.1
N$17
  Top 0.152: R16.1 73.27,5.64 LCD1.36
N$18
  Top 0.152: C13.1 66.36,5.64 LCD1.38 LCD1.37
N$19
  Top 0.152: R24.2 R25.1 96.34,12.7 U12.5
N$22
  Top 0.152: D3.A 53.34,9.4 53.34,3.81 52.07,2.54 48.26,2.54 48.26,4.02 47.25,5.03 47.25,6.4 48.26,7.41 ISP.4
N$23
  Top 0.152: D4.C 44.23,17.49 44.23,17.32 49.11,12.44 49.58,12.44 50.8,11.22 ISP.L6 50.42,8.89 ISP.6
N$24
  Top 0.152: U10.1 7.69,15.76 7.4,16.05 7.4,18.32 D1.A
N$25
  Top 0.152: C5.2 98.36,35.56 U6.8
N$26
  Top 0.152: U6.2 U6.3 | C6.2 87.82,33.66 U6.3 | U6.3 94.84,33.66 96.64,31.86 98.8,31.86 98.93,31.99 98.93,32.78 98.8,32.91 98.46,32.91 U6.6 U6.7 100.83,34.92 101.17,34.58 106.97,34.58 U4.9 115.83,35.56 116.56,34.83 120.24,34.83 R22.1
N$27
  Top 0.152: U8.8 98.36,45.72 C15.1 102.1,45.72 103.08,46.7 119.99,46.7 R21.1 118.43,38.1 U4.12
N$28
  Top 0.152: U10.4 7.49,10.68 6.61,10.68 4.57,12.72 D2.C
N$30
  Top 0.152: U12.2 U12.1 89,15.71 88.18,16.52 86.54,16.52 R5.2
N$31
  Top 0.152: U12.6 U12.7 97.22,15.24 96.57,15.24 96.44,15.37 96.44,16.04 99.14,18.74 99.14,20.88 99,21.02 98.34,21.02 U2.16 98.34,21.45 99,21.45 99.14,21.59 99.14,22.18 99,22.32 98.34,22.32 U2.18 101.59,22.54 C1.1
N$32
  Top 0.152: USB.B7 9.34,29.61 9.87,29.07 10.21,29.07 USB.A7 11.17,28.96 11.87,28.26 U7.3 12.71,25.71 R12.2
N$33  (via drill 0.35)
  Top 0.152: USB.A6 10.43,29.35 10.76,29.35 10.78,29.33 v11.55,29.33 12.38,30.16 U7.1 12.71,32.71 R13.2
  Bottom 0.152: USB.B6 9.41,29.21 11.43,29.21 v11.55,29.33
N$34  (via drill 0.35)
  Top 0.381: USB.A4 9.06,30.46 USB.B9 | USB.A9 9.06,27.96 USB.B4 | v13.97,27.94 14.91,27.94 U7.4 v15.23,29.2 v15.24,29.21 | v3.56,38.48 3.56,38.97 F1.2
  Bottom 0.381: USB.B4 13.9,28.01 | 13.9,28.01 v13.97,27.94 | USB.B9 11.5,30.41 13.9,28.01 | v15.24,29.21 15.24,30.84 15.88,31.48 15.88,32.02 15.88,32.03 15.88,36.7 14.48,38.1 3.94,38.1 v3.56,38.48
N$35
  Top 0.152: U2.10 92.16,20.8 90.23,20.8 89.15,21.88 86.56,21.88 85.59,22.86 C2.1
N$36
  Top 0.152: U2.9 92.16,21.45 90.23,21.45 88.82,22.86 C2.2
PWR_CPU  (via drill 0.35)
  Top 0.152: U5.11 60.73,29.88 60.73,29.33 59.34,27.94 v44.45,27.94 | v27.94,11.43 R18.1
  Bottom 0.152: v44.45,27.94 v27.94,11.43
PWR_SW  (via drill 0.35)
  Top 0.152: R7.1 30.24,21.59 Q4.1 33.52,20.82 v36.83,24.13
  Bottom 0.152: SW1.3 36.83,25.91 v36.83,24.13
RESET  (via drill 0.35)
  Top 0.152: v61.85,36.2 61.83,36.21 U5.29 61.67,38.55 v61.67,40.51 | ISP.5 50.42,7.62 ISP.L5 | v76.2,34.29 R11.2
  Bottom 0.152: v61.85,36.2 61.85,35.42 62.51,34.76 62.51,18.06 51.69,7.24 ISP.L5 | v61.67,40.51 69.98,40.51 v76.2,34.29
RIGHT  (via drill 0.35)
  Top 0.152: v57.15,29.21 59.05,29.21 59.06,29.2 59.8,29.2 59.93,29.33 59.93,29.88 U5.10
  Bottom 0.152: SW1.5 21.71,28.3 20.48,27.07 20.48,24.98 20.61,24.85 22.8,24.85 22.94,24.98 22.94,25.3 26.84,29.21 v57.15,29.21
RXD  (via drill 0.35)
  Top 0.152: v34.92,9.14 34.92,14.35 38.35,17.78 D3.C v42.67,17.78 | v6.22,17.4 D1.C | U5.30 61.03,35.63 v60.96,35.56
  Bottom 0.152: v6.22,17.4 6.22,15.24 10.01,11.45 10.01,9.81 13.29,6.53 34.08,6.53 34.95,7.4 34.95,9.12 v34.92,9.14 | v42.67,17.78 49.86,24.97 56.56,24.97 60.88,29.28 60.88,35.48 v60.96,35.56
SCK  (via drill 0.35)
  Top 0.152: ISP.7 48.26,9.02 47.24,10.03 47.24,11.81 v47.5,12.06 | v61.88,24.51 63.15,24.51 v63.77,25.13 66.29,27.65 66.29,31.44 U5.17 | U11.6 v70.48,18.41
  Bottom 0.152: v63.77,25.13 v70.48,18.41 83.43,5.47 LCD1.32 | v47.5,12.06 59.94,24.51 v61.88,24.51
SELECT  (via drill 0.35)
  Top 0.152: U5.32 59.69,38.14 v59.69,36.83 | v30.48,7.62 32.49,5.61 Q1.3
  Bottom 0.152: v59.69,36.83 59.69,29.46 56.9,26.67 44.45,26.67 30.48,12.7 v30.48,7.62
SENSE_OUT  (via drill 0.35)
  Top 0.152: v88.9,31.37 88.39,31.37 83.26,26.25 83.26,17.96 85,16.22 88.06,16.22 89.87,14.41 U12.3
  Bottom 0.152: v88.9,31.37 88.94,31.41 124.12,31.41 OPHIR.1
TXD  (via drill 0.35)
  Top 0.152: D4.A 44.45,20.32 | 44.45,20.32 42.59,20.32 42,20.91 40.8,20.91 34.29,14.4 v34.29,7.62 | v10.79,16.64 8.26,16.64 D2.A | v49.53,25.4 44.45,20.32 | v60.22,36.2 U5.31
  Bottom 0.152: v34.29,7.62 31.23,7.62 30.57,6.96 20.46,6.96 10.79,16.62 v10.79,16.64 | v60.22,36.2 60.25,36.17 60.25,29.34 56.31,25.4 v49.53,25.4
UP  (via drill 0.35)
  Top 0.152: U5.1 v56.77,37.09 v56.77,37.08
  Bottom 0.152: SW1.4 27.01,34.93 28.19,33.75 53.44,33.75 v56.77,37.08
V+
  Top 0.381: BAT.2 5.41,47.32 8.26,50.16 | 8.26,50.16 10.16,52.07 16.51,52.07 19.05,49.53 19.05,45.72 21.35,43.42 Q5.3 22.38,22.39 R7.2 25.08,19.69 R19.1 25.85,19.82 Q4.2 | U3.2 11.43,46.99 8.26,50.16
V_BAT  (via drill 0.35)
  Top 0.152: R30.2 R29.1 v45.72,35.56 | v64.77,35.56 66.27,35.56 U5.22
  Bottom 0.152: v45.72,35.56 54.36,35.56 56.52,37.72 62.61,37.72 v64.77,35.56
V_SWITCHED
  Top 0.381: Q5.2 Q5.4 28.42,43.46 30.73,41.15 31.94,41.15 C3.1 38.65,43.18 U1.3 38.89,37.31 40.64,35.56 R29.2
VCC
  Top 0.381: LCD1.40 LCD1.39 67.81,1.65 106.67,1.65 LCD1.22 | LCD1.22 108.83,6.42 107.79,7.46 | 107.79,7.46 C11.1 | 107.79,7.46 110.33,7.46 U9.5 119.38,13.97 R23.1 C17.1 | LCD1.22 LCD1.21